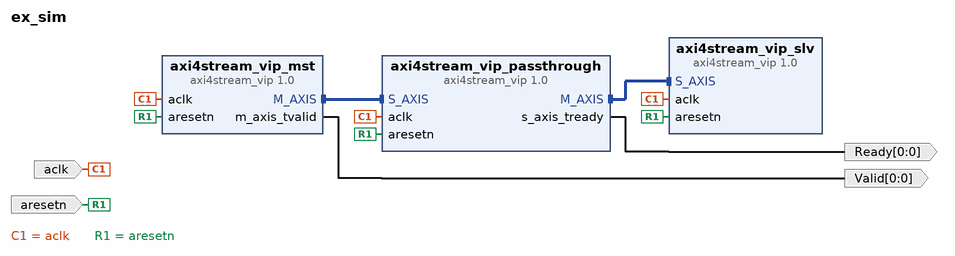
[diagram p0: block diagram of the top level]
# Vivado block design ex_sim, xc7a100tcsg324-1, Vivado 2017.2
create_bd_design ex_sim

create_bd_port -dir I -type clk aclk
set_property -dict [list \
  CONFIG.FREQ_HZ 300000000 \
  CONFIG.PHASE 0.0 \
  CONFIG.CLK_DOMAIN design_sim_clk_wiz_0_0_clk_out1 \
] [get_bd_ports aclk]
create_bd_port -dir I -type rst aresetn
set_property -dict {CONFIG.POLARITY ACTIVE_LOW} [get_bd_ports aresetn]
create_bd_port -dir O -from 0 -to 0 Valid
create_bd_port -dir O -from 0 -to 0 Ready

create_bd_cell -type ip -vlnv xilinx.com:ip:axi4stream_vip:1.0 axi4stream_vip_mst
set_property -dict [list \
  CONFIG.INTERFACE_MODE MASTER \
  CONFIG.TDATA_NUM_BYTES 4 \
  CONFIG.HAS_TUSER_BITS_PER_BYTE 0 \
  CONFIG.TID_WIDTH 0 \
  CONFIG.TDEST_WIDTH 0 \
  CONFIG.TUSER_WIDTH 0 \
  CONFIG.HAS_TREADY 1 \
  CONFIG.HAS_TSTRB 0 \
  CONFIG.HAS_TKEEP 0 \
  CONFIG.HAS_TLAST 0 \
  CONFIG.HAS_ACLKEN 0 \
  CONFIG.HAS_ARESETN 1 \
] [get_bd_cells axi4stream_vip_mst]
create_bd_cell -type ip -vlnv xilinx.com:ip:axi4stream_vip:1.0 axi4stream_vip_passthrough
set_property -dict [list \
  CONFIG.INTERFACE_MODE PASS_THROUGH \
  CONFIG.TDATA_NUM_BYTES 4 \
  CONFIG.TID_WIDTH 0 \
  CONFIG.TDEST_WIDTH 0 \
  CONFIG.HAS_TREADY 1 \
  CONFIG.HAS_TSTRB 0 \
  CONFIG.HAS_TKEEP 0 \
  CONFIG.HAS_TLAST 0 \
  CONFIG.HAS_ACLKEN 0 \
  CONFIG.HAS_ARESETN 1 \
] [get_bd_cells axi4stream_vip_passthrough]
create_bd_cell -type ip -vlnv xilinx.com:ip:axi4stream_vip:1.0 axi4stream_vip_slv
set_property -dict [list \
  CONFIG.INTERFACE_MODE SLAVE \
  CONFIG.TDATA_NUM_BYTES 4 \
  CONFIG.TID_WIDTH 0 \
  CONFIG.TDEST_WIDTH 0 \
  CONFIG.HAS_TREADY 1 \
  CONFIG.HAS_TSTRB 0 \
  CONFIG.HAS_TKEEP 0 \
  CONFIG.HAS_TLAST 0 \
  CONFIG.HAS_ACLKEN 0 \
  CONFIG.HAS_ARESETN 1 \
] [get_bd_cells axi4stream_vip_slv]

# ---- connections ----

connect_bd_intf_net [get_bd_intf_pins axi4stream_vip_slv/S_AXIS] [get_bd_intf_pins axi4stream_vip_passthrough/M_AXIS]
connect_bd_intf_net [get_bd_intf_pins axi4stream_vip_passthrough/S_AXIS] [get_bd_intf_pins axi4stream_vip_mst/M_AXIS]
connect_bd_net [get_bd_ports aclk] \
  [get_bd_pins axi4stream_vip_mst/aclk] [get_bd_pins axi4stream_vip_passthrough/aclk] [get_bd_pins axi4stream_vip_slv/aclk]
connect_bd_net [get_bd_ports aresetn] \
  [get_bd_pins axi4stream_vip_mst/aresetn] [get_bd_pins axi4stream_vip_passthrough/aresetn] \
  [get_bd_pins axi4stream_vip_slv/aresetn]
connect_bd_net [get_bd_pins axi4stream_vip_mst/m_axis_tvalid] [get_bd_ports Valid]
connect_bd_net [get_bd_pins axi4stream_vip_passthrough/s_axis_tready] [get_bd_ports Ready]

validate_bd_design
save_bd_design
